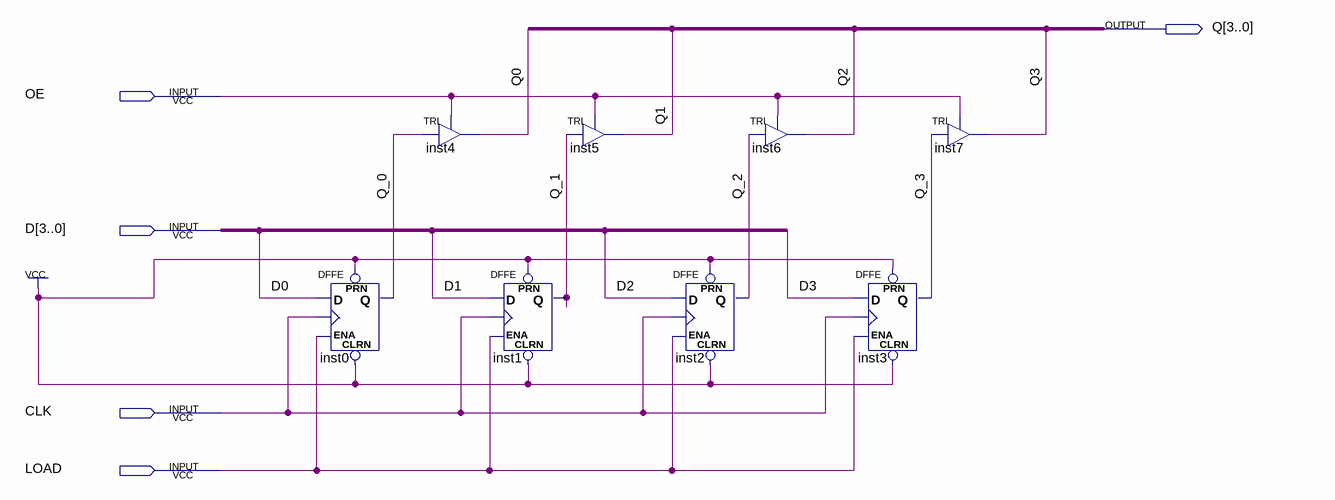
[diagram p0: schematic sheet]
// Quartus schematic REG4.bdf as structural Verilog: 8 symbols, 5 pins
module REG4 (
  input  OE,
  input  [3:0] D,
  input  CLK,
  input  LOAD,
  output [3:0] Q
);

  wire Q_0, Q_1, Q_2, Q_3;

  DFFE inst0 (.PRN(1'b1), .CLRN(1'b1), .D(D[0]), .CLK(CLK), .ENA(LOAD), .Q(Q_0));
  TRI inst4 (.IN(Q_0), .OE(OE), .OUT(Q[0]));
  DFFE inst1 (.PRN(1'b1), .CLRN(1'b1), .D(D[1]), .CLK(CLK), .ENA(LOAD), .Q(Q_1));
  TRI inst5 (.IN(Q_1), .OE(OE), .OUT(Q[1]));
  DFFE inst2 (.PRN(1'b1), .CLRN(1'b1), .D(D[2]), .CLK(CLK), .ENA(LOAD), .Q(Q_2));
  TRI inst6 (.IN(Q_2), .OE(OE), .OUT(Q[2]));
  DFFE inst3 (.PRN(1'b1), .CLRN(1'b1), .D(D[3]), .CLK(CLK), .ENA(LOAD), .Q(Q_3));
  TRI inst7 (.IN(Q_3), .OE(OE), .OUT(Q[3]));
endmodule
